# EAGLE design supply_board (EAGLE 7.7.0)
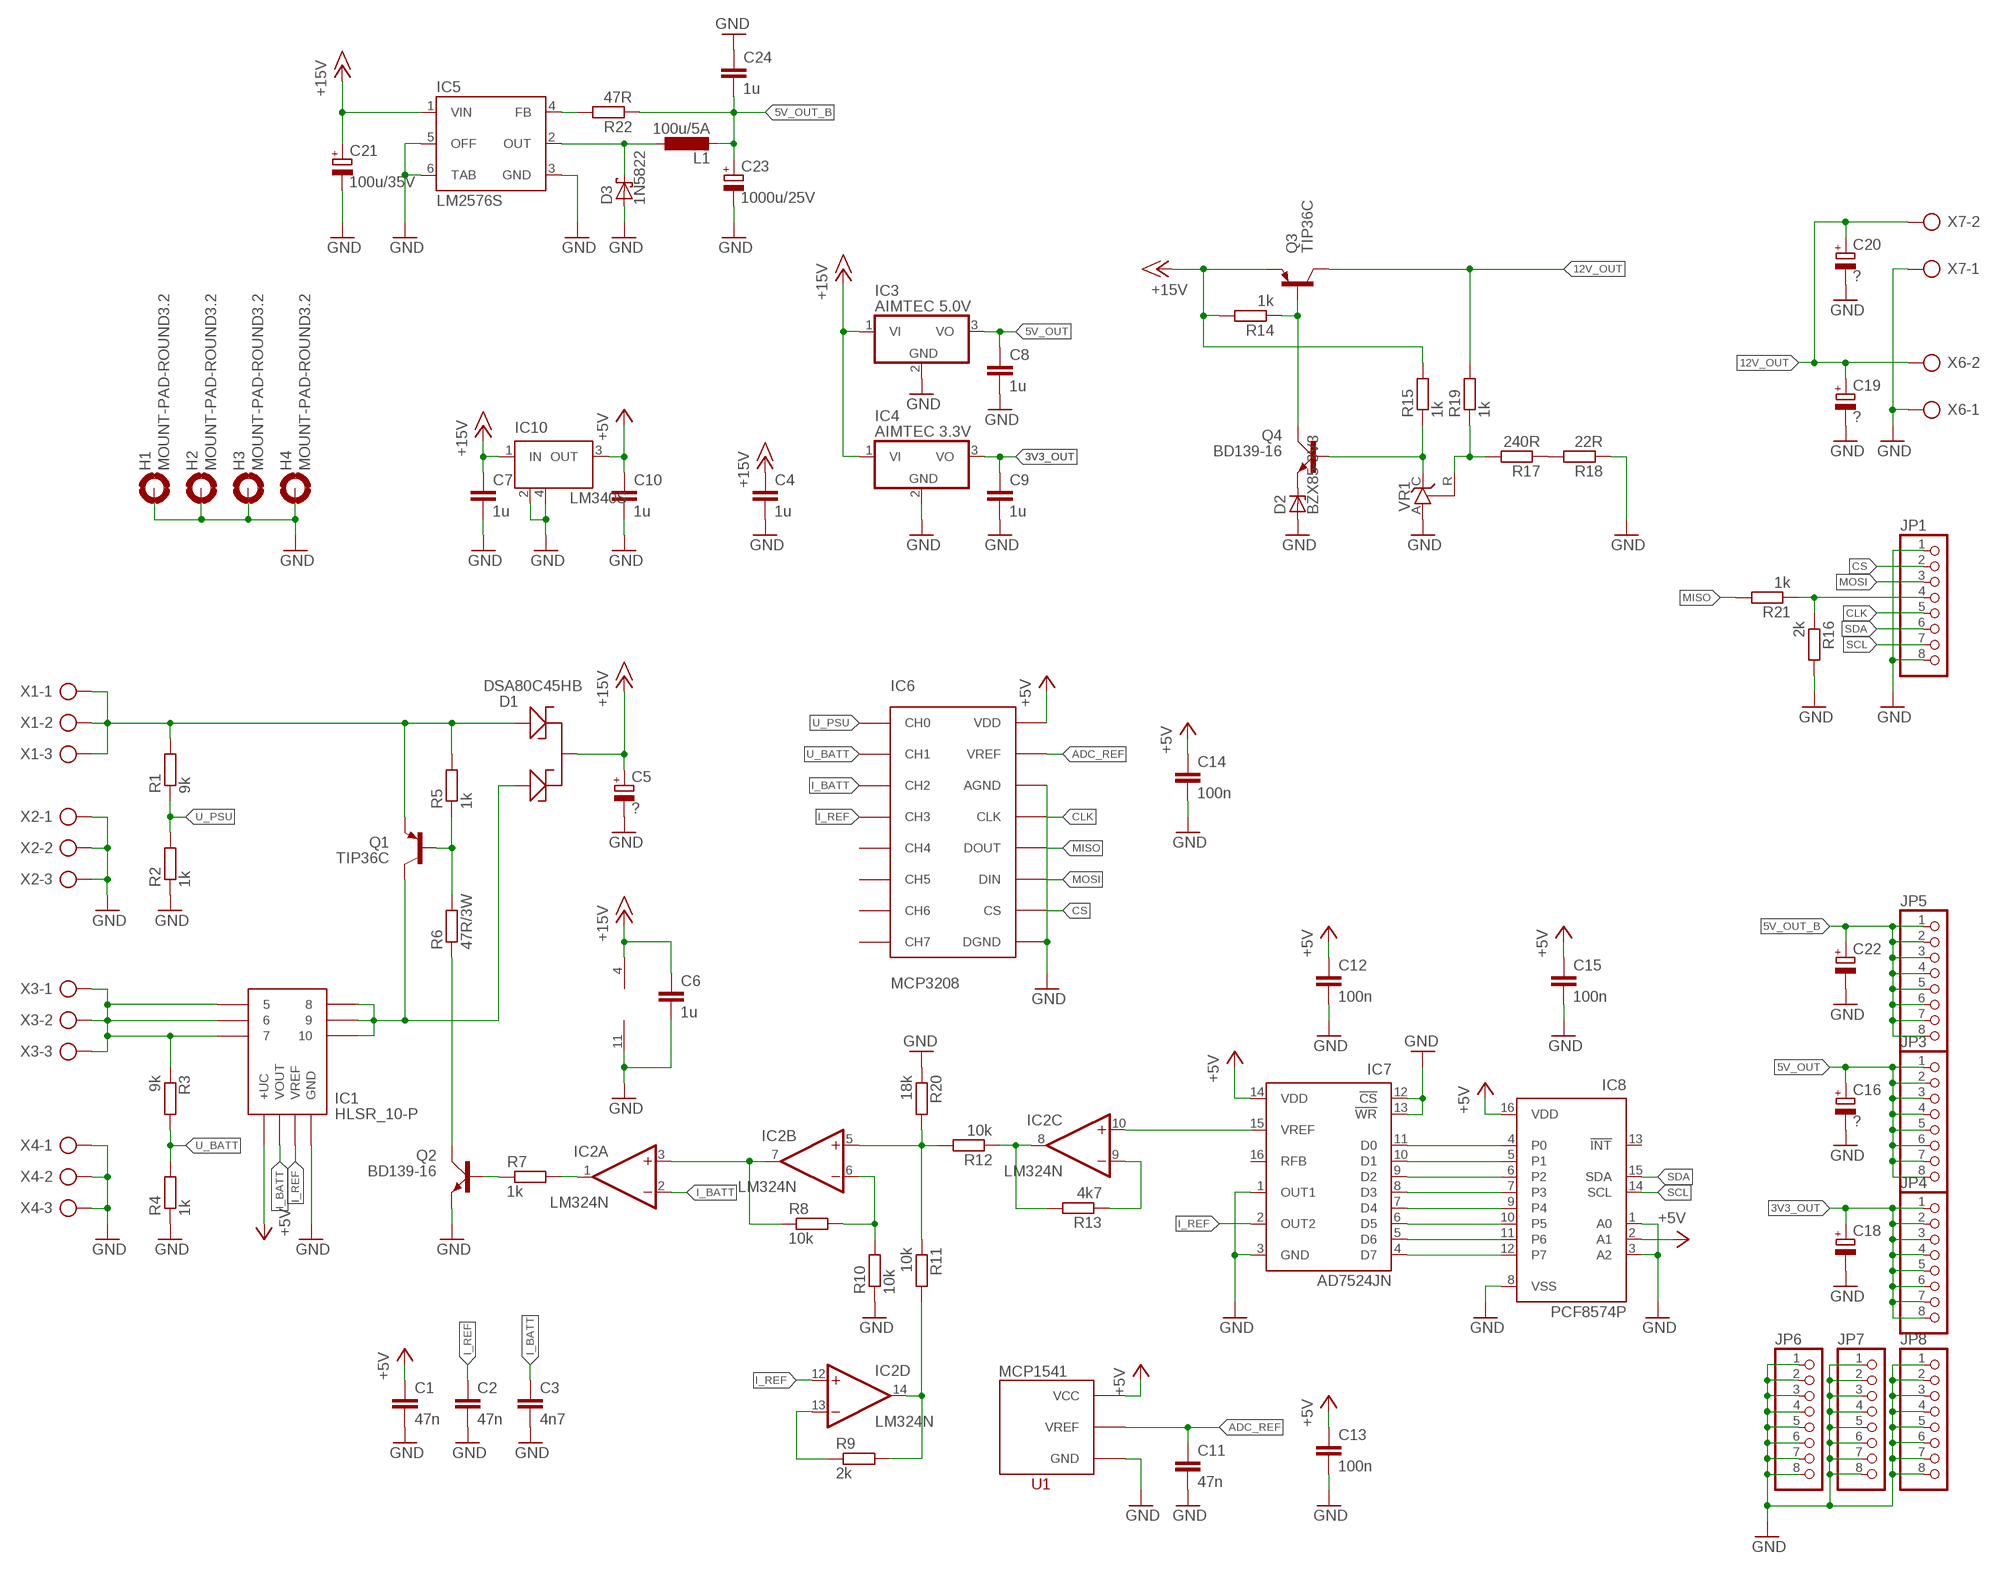
[diagram p0: schematic, sheet 1]

## Parts
C1  47n  C-EUC0805  [C0805]
C2  47n  C-EUC0805  [C0805]
C3  4n7  C-EUC0805  [C0805]
C4  1u  C-EUC0805  [C0805]
C5  ?  CPOL-EUE5-13  [E5-13]
C6  1u  C-EUC0805  [C0805]
C7  1u  C-EUC0805  [C0805]
C8  1u  C-EUC0805  [C0805]
C9  1u  C-EUC0805  [C0805]
C10  1u  C-EUC0805  [C0805]
C11  47n  C-EUC0805  [C0805]
C12  100n  C-EUC0805  [C0805]
C13  100n  C-EUC0805  [C0805]
C14  100n  C-EUC0805  [C0805]
C15  100n  C-EUC0805  [C0805]
C16  ?  CPOL-EUE2.5-6  [E2,5-6]
C18  CPOL-EUE2.5-6  [E2,5-6]
C19  ?  CPOL-EUE5-13  [E5-13]
C20  ?  CPOL-EUE5-13  [E5-13]
C21  100u/35V  CPOL-EUE5-10.5  [E5-10,5]
C22  CPOL-EUE2.5-6  [E2,5-6]
C23  1000u/25V  CPOL-EUE5-10.5  [E5-10,5]
C24  1u  C-EUC0805  [C0805]
D1  DSA80C45HB  [TO247BV]
D2  BZX85-3V3  BZX85  [DO41Z10]
D3  1N5822  1N5908  [C4111-15]
H1  MOUNT-PAD-ROUND3.2  [3,2-PAD]
H2  MOUNT-PAD-ROUND3.2  [3,2-PAD]
H3  MOUNT-PAD-ROUND3.2  [3,2-PAD]
H4  MOUNT-PAD-ROUND3.2  [3,2-PAD]
IC1  HLSR_10-P  [HLSR16-P]
IC2  LM324N  [DIL14]
IC3  AIMTEC 5.0V  7805TV  [TO220V]
IC4  AIMTEC 3.3V  7805TV  [TO220V]
IC5  LM2576S  [TO263-5]
IC6  MCP3208  [DIL16]
IC7  AD7524JN  [DIL16]
IC8  PCF8574P  [DIL16]
IC10  LM340S  [SOT223]
JP1  PINHD-1X8  [1X08]
JP3  PINHD-1X8  [1X08]
JP4  PINHD-1X8  [1X08]
JP5  PINHD-1X8  [1X08]
JP6  PINHD-1X8  [1X08]
JP7  PINHD-1X8  [1X08]
JP8  PINHD-1X8  [1X08]
L1  100u/5A  L-EUTJ5-U2  [TJ5-U2]
Q1  TIP36C  TIP36-V  [TO247-V]
Q2  BD139-16  BD139  [TO126AV]
Q3  TIP36C  TIP36-V  [TO247-V]
Q4  BD139-16  BD139  [TO126AV]
R1  9k  R-EU_R0805  [R0805]
R2  1k  R-EU_R0805  [R0805]
R3  9k  R-EU_R0805  [R0805]
R4  1k  R-EU_R0805  [R0805]
R5  1k  R-EU_R0805  [R0805]
R6  47R/3W  R-EU_0617/22  [0617/22]
R7  1k  R-EU_R0805  [R0805]
R8  10k  R-EU_R0805  [R0805]
R9  2k  R-EU_R0805  [R0805]
R10  10k  R-EU_R0805  [R0805]
R11  10k  R-EU_R0805  [R0805]
R12  10k  R-EU_R0805  [R0805]
R13  4k7  R-EU_R0805  [R0805]
R14  1k  R-EU_R0805  [R0805]
R15  1k  R-EU_R0805  [R0805]
R16  2k  R-EU_R0805  [R0805]
R17  240R  R-EU_R0805  [R0805]
R18  22R  R-EU_R0805  [R0805]
R19  1k  R-EU_R0805  [R0805]
R20  18k  R-EU_R0805  [R0805]
R21  1k  R-EU_R0805  [R0805]
R22  47R  R-EU_R0805  [R0805]
U1  VOLT_REFERENCE  [SOT23]
VR1  TL431CLP  [TO92-CLP]
X1  AK500/3  [AK500/3]
X2  AK500/3  [AK500/3]
X3  AK500/3  [AK500/3]
X4  AK500/3  [AK500/3]
X6  AK500/2  [AK500/2]
X7  AK500/2  [AK500/2]

## Nets
3V3_OUT: C9.1 C18.+ IC4.3(VO) JP4.1 JP4.2 JP4.3 JP4.4 JP4.5 JP4.6 JP4.7 JP4.8
5V_OUT: C8.1 C16.+ IC3.3(VO) JP3.1 JP3.2 JP3.3 JP3.4 JP3.5 JP3.6 JP3.7 JP3.8
5V_OUT_B: C22.+ C23.+ C24.2 JP5.1 JP5.2 JP5.3 JP5.4 JP5.5 JP5.6 JP5.7 JP5.8 L1.2 R22.1
12V_OUT: C19.+ C20.+ Q3.2(C) R19.2 X6.2 X7.2
+5V: C1.1 C10.1 C12.1 C13.1 C14.1 C15.1 IC1.4(+UC) IC6.VDD IC7.14(VDD) IC8.2(A1) IC8.16(VDD) IC10.3(OUT) U1.1(VCC)
+15V: C4.1 C5.+ C6.1 C7.1 C21.+ D1.2 IC2.4(P:V+) IC3.1(VI) IC4.1(VI) IC5.1(VIN) IC10.1(IN) Q3.3(E) R14.2 R15.2
ADC_REF: C11.1 IC6.VREF U1.2(VREF)
CLK: IC6.CLK JP1.5
CS: IC6.CS JP1.2
GND: C1.2 C2.2 C3.2 C4.2 C5.- C6.2 C7.2 C8.2 C9.2 C10.2 C11.2 C12.2 C13.2 C14.2 C15.2 C16.- C18.- C19.- C20.- C21.- C22.- C23.- C24.1 D2.A D3.A H1.B3,2(MOUNT) H2.B3,2(MOUNT) H3.B3,2(MOUNT) H4.B3,2(MOUNT) IC1.3(GND) IC2.11(P:V-) IC3.2(GND) IC4.2(GND) IC5.3(GND) IC5.5(OFF) IC5.6(TAB) IC6.AGND IC6.DGND IC7.1(OUT1) IC7.3(GND) IC7.12(!CS) IC7.13(!WR) IC8.1(A0) IC8.3(A2) IC8.8(VSS) IC10.2(GND) JP1.1 JP1.8 JP6.1 JP6.2 JP6.3 JP6.4 JP6.5 JP6.6 JP6.7 JP6.8 JP7.1 JP7.2 JP7.3 JP7.4 JP7.5 JP7.6 JP7.7 JP7.8 JP8.1 JP8.2 JP8.3 JP8.4 JP8.5 JP8.6 JP8.7 JP8.8 Q2.E R2.1 R4.1 R10.1 R16.2 R18.1 R20.1 U1.3(GND) VR1.A X2.1 X2.2 X2.3 X4.1 X4.2 X4.3 X6.1 X7.1
I_BATT: C3.1 IC1.2(VOUT) IC2.2(A:-IN) IC6.CH2
I_REF: C2.1 IC1.1(VREF) IC2.12(D:+IN) IC6.CH3 IC7.2(OUT2)
MISO: IC6.DOUT R21.2
MOSI: IC6.DIN JP1.3
N$1: IC1.5 IC1.6 IC1.7 R3.1 X3.1 X3.2 X3.3
N$2: D1.3 IC1.8 IC1.9 IC1.10 Q1.2(C)
N$3: Q1.1(B) R5.1 R6.2
N$4: Q2.C R6.1
N$5: IC2.6(B:-IN) R8.2 R10.2
N$6: D1.1 Q1.3(E) R1.2 R5.2 X1.1 X1.2 X1.3
N$7: Q2.B R7.1
N$8: IC2.1(A:OUT) R7.2
N$9: IC2.13(D:-IN) R9.1
N$10: IC2.3(A:+IN) IC2.7(B:OUT) R8.1
N$11: IC2.14(D:OUT) R9.2 R11.2
N$12: IC2.5(B:+IN) R11.1 R12.2 R20.2
N$13: IC2.8(C:OUT) R12.1 R13.2
N$14: IC7.11(D0) IC8.4(P0)
N$15: IC7.10(D1) IC8.5(P1)
N$16: IC7.9(D2) IC8.6(P2)
N$17: IC7.8(D3) IC8.7(P3)
N$18: Q3.1(B) Q4.C R14.1
N$19: IC7.7(D4) IC8.9(P4)
N$20: IC7.6(D5) IC8.10(P5)
N$21: IC7.5(D6) IC8.11(P6)
N$22: IC7.4(D7) IC8.12(P7)
N$23: Q4.B R15.1 VR1.C
N$24: D2.C Q4.E
N$25: IC2.9(C:-IN) R13.1
N$26: IC2.10(C:+IN) IC7.15(VREF)
N$27: JP1.4 R16.1 R21.1
N$30: R17.1 R18.2
N$31: IC5.4(FB) R22.2
N$32: R17.2 R19.1 VR1.R
N$33: D3.C IC5.2(OUT) L1.1
SCL: IC8.14(SCL) JP1.7
SDA: IC8.15(SDA) JP1.6
U_BATT: IC6.CH1 R3.2 R4.2
U_PSU: IC6.CH0 R1.1 R2.2
Unconnected: IC6.CH4 IC6.CH5 IC6.CH6 IC6.CH7 IC7.16(RFB) IC8.13(!INT)

## Power pins joined to a net without a drawn wire
GND: IC10.4(GND)

## Library data of the parts
C1-C4 C6-C15 C24 = rcl:C-EU: CAPACITOR, European symbol
C5 C16 C18-C23 = rcl:CPOL-EU: POLARIZED CAPACITOR, European symbol
D1 = DSA80C45HB:DSA80C45HB: DSA80C45HB
D2 = diode:BZX85: Z DIODE
D3 = diode:1N5908: DIODE schottky
H1-H4 = holes:MOUNT-PAD-ROUND: MOUNTING PAD, round
IC1 = HLSR_10-P:HLSR_10-P: LEM ASIC Open Loop Hall Effect Current Sensor, Maximum of 25 A, 10A output current Source: Datasheet <http://www.lem.com/docs/products/hlsr-p_series.pdf>; DESCRIPTION: LEM ASIC Open Loop Hall Effect Current Sensor, Maximum of 25 A, 10A output current; HEIGHT: mm; MANUFACTURER_NAME: LEM; MANUFACTURER_PART_NUMBER: HLSR 10-P; RS_PART_NUMBER: 7934584; RS_PRICE-STOCK: http://uk.rs-online.com/web/p/products/7934584
IC2 = linear:LM324: OP AMP
IC3 IC4 = linear:78*: Positive VOLTAGE REGULATOR Source: http://cache.national.com/ds/LM/LM78L05.pdf http://www.fairchildsemi.com/ds/LM/LM7805.pdf
IC5 = v-reg-3:LM2576: National Semiconductor <http://www.national.com> 3.0A "Simple Switcher"(c) 52kHz, Vout 1.23-37V (HV: 57V), Vin 40V (HV: 60V), 50µA standby current
IC6 = mcp3208:MCP3208
IC7 = analog-devices:AD7524*: 8-Bit Buffered Multiplying DAC Source: http://www.analog.com/UploadedFiles/Data_Sheets/888358036ad7524.pdf; MF: ALTERA CORPORATION; MPN: AD7524JNZ; OC_FARNELL: 9605401; OC_NEWARK: 59K4969
IC8 = micro-philips:PCF8574: I2C-Bus Remote 8-bit I/O expander http://www.semiconductors.philips.com/acrobat_download/datasheets/PCF8574_4.pdf; MPN: PCF8574PN; OC_FARNELL: 204020; OC_NEWARK: 11N8515
IC10 = linear:LM340S: 3-Terminal Positive Regulators Source: http://cache.national.com/ds/LM/LM340.pdf
JP1 JP3-JP8 = pinhead:PINHD-1X8: PIN HEADER
L1 = rcl:L-EU: INDUCTOR, European symbol
Q1 Q3 = transistor-pnp2:TIP36: PNP Power Transistor
Q2 Q4 = transistor-power:BD139: NPN TRANSISTOR
R1-R5 R7-R22 = resistor:R-EU_: RESISTOR, European symbol
R6 = rcl:R-EU_: RESISTOR, European symbol
U1 = icnh3:VOLT_REFERENCE
VR1 = v-reg:TL431CLP: VOLTAGE REGULATOR
X1-X4 = con-ptr500:AK500/3: CONNECTOR; OC_FARNELL: unknown; OC_NEWARK: unknown
X6 X7 = con-ptr500:AK500/2: CONNECTOR; OC_FARNELL: unknown; OC_NEWARK: unknown

## Board
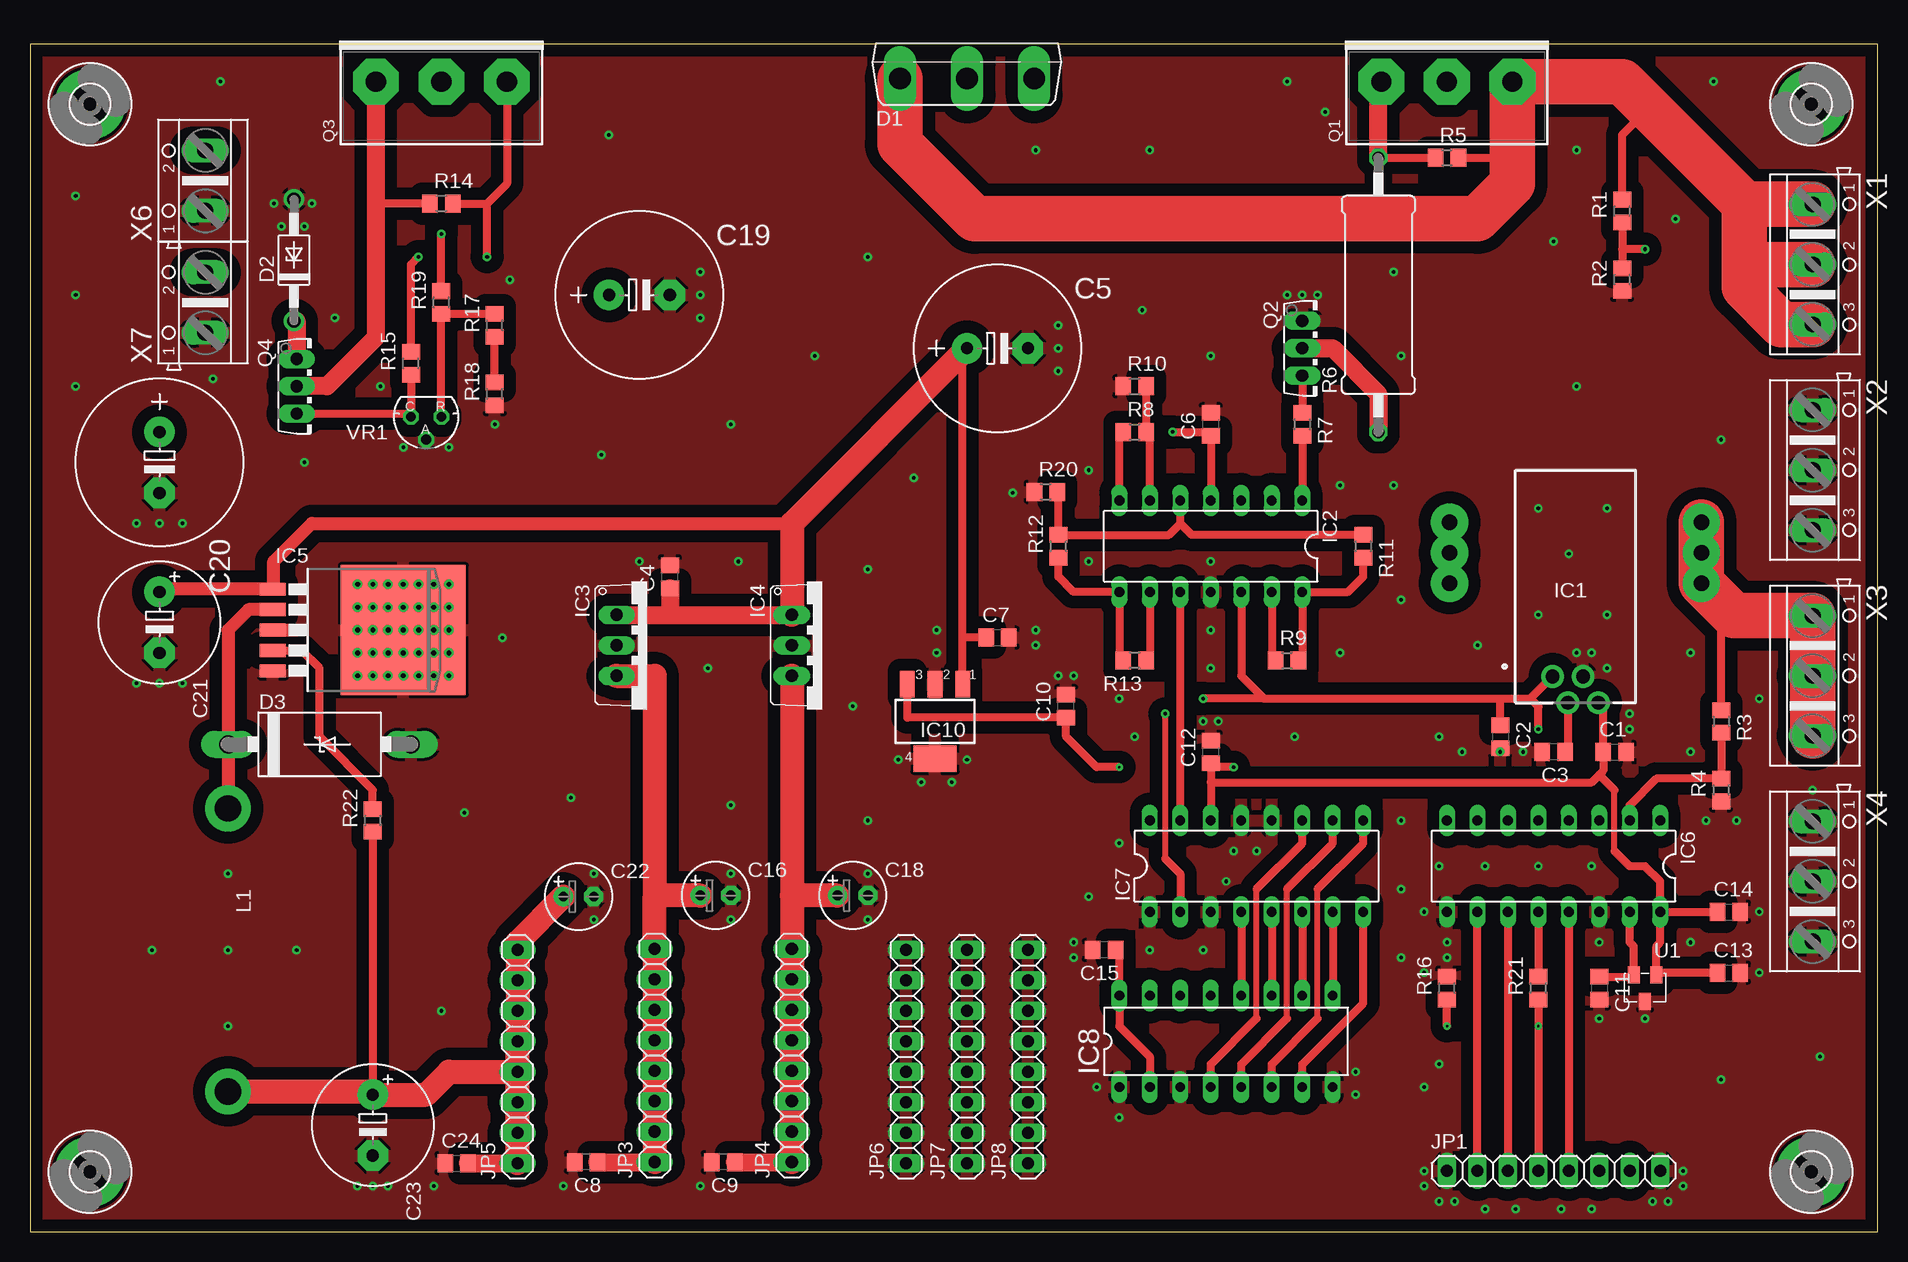
[diagram p1: board, top side]
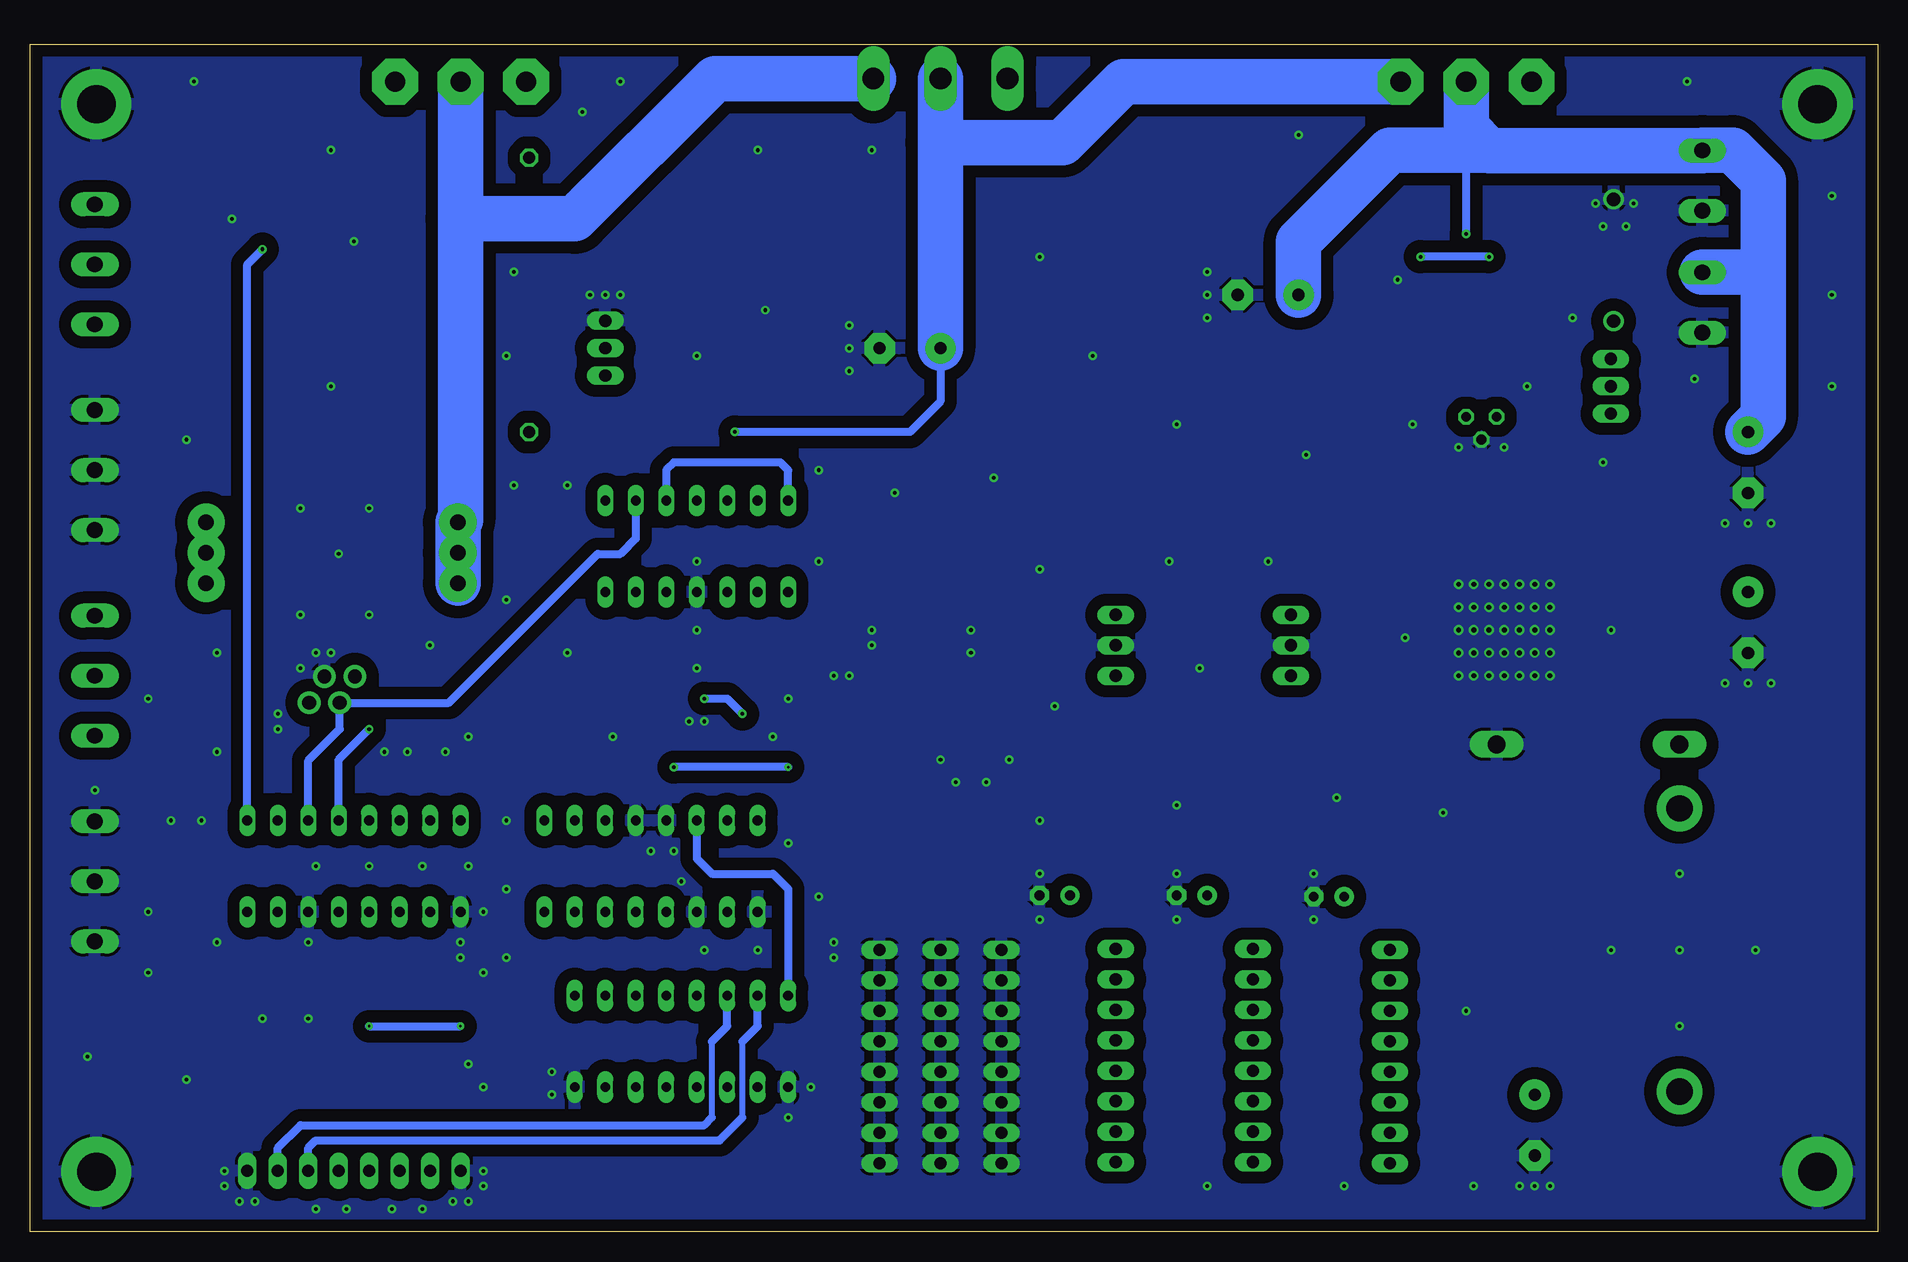
[diagram p2: board, bottom side, seen from below]

Size 154 x 99 mm. Coordinates in mm from the lower left corner, seen from the top.
Outline: 0,0 154,0 154,99 0,99 0,0
Copper layers (1*16): Top 0.035mm / dielectric 1.5mm / Bottom 0.035mm
Design rules "default *": minimum track width 10mil, minimum drill 24mil, track to track 8mil, track to pad 8mil, pad to pad 8mil, via to via 8mil, smd to smd 8mil, copper to edge 40mil, drill to drill 8mil, minimum pad ring 10mil, minimum via ring 8mil, stop-mask expansion 4mil, vias tented up to drill 0.3mm, thermal gap 10mil

### Footprints (pad centres in the part's own frame; a part is rotated, then mirrored left to right if it is on the bottom)
C0805 = smd 1.3 x 1.5: 1 -0.95,0; 2 0.95,0
E5-13 = drill 1.016 pad 2.54: + -2.54,0 | drill 1.016 pad 2.54 octagon: - 2.54,0
E2,5-6 = drill 0.813 pad 1.6: + -1.27,0 | drill 0.813 pad 1.6 octagon: - 1.27,0
E5-10,5 = drill 1.016 pad 2.54: + -2.54,0 | drill 1.016 pad 2.54 octagon: - 2.54,0
TO247BV = drill 1.8 long: 1 -5.588,-2.921; 2 0,-2.921; 3 5.588,-2.921
DO41Z10 = drill 1.118: A 5.08,0; C -5.08,0
C4111-15 = drill 1.499 long: A 7.62,0; C -7.62,0
3,2-PAD = drill 3.2 pad 5.842: B3,2 0,0
HLSR16-P = drill 1.15 pad 1.9: 1 3.09,-17.2; 2 4.36,-19.4; 3 5.63,-17.2; 4 6.9,-19.4 | drill 1.3 pad 3.1: 5 15.5,-9.43; 6 15.5,-6.89; 7 15.5,-4.35; 8 -5.5,-4.35; 9 -5.5,-6.89; 10 -5.5,-9.43
DIL14 = drill 0.813 long: 1 -7.62,-3.81; 2 -5.08,-3.81; 3 -2.54,-3.81; 4 0,-3.81; 5 2.54,-3.81; 6 5.08,-3.81; 7 7.62,-3.81; 8 7.62,3.81; 9 5.08,3.81; 10 2.54,3.81; 11 0,3.81; 12 -2.54,3.81; 13 -5.08,3.81; 14 -7.62,3.81
TO220V = drill 1.016 long: 1 -2.54,-2.54; 2 0,-2.54; 3 2.54,-2.54
TO263-5 = smd 1.067 x 2.159: 1 -3.404,-5.791; 2 -1.702,-5.791; 3 0,-5.791; 4 1.702,-5.791; 5 3.404,-5.791 | smd 10.8 x 10.41: 6 0,5.08
DIL16 = drill 0.813 long: AGND -3.81,3.81; CH0 -8.89,-3.81; CH1 -6.35,-3.81; CH2 -3.81,-3.81; CH3 -1.27,-3.81; CH4 1.27,-3.81; CH5 3.81,-3.81; CH6 6.35,-3.81; CH7 8.89,-3.81; CLK -1.27,3.81; CS 6.35,3.81; DGND 8.89,3.81; DIN 3.81,3.81; DOUT 1.27,3.81; VDD -8.89,3.81; VREF -6.35,3.81
DIL16' = drill 0.813 long: 1 -8.89,-3.81; 2 -6.35,-3.81; 3 -3.81,-3.81; 4 -1.27,-3.81; 5 1.27,-3.81; 6 3.81,-3.81; 7 6.35,-3.81; 8 8.89,-3.81; 9 8.89,3.81; 10 6.35,3.81; 11 3.81,3.81; 12 1.27,3.81; 13 -1.27,3.81; 14 -3.81,3.81; 15 -6.35,3.81; 16 -8.89,3.81
SOT223 = smd 1.219 x 2.235: 1 -2.311,-3.099; 2 0,-3.099; 3 2.311,-3.099 | smd 3.6 x 2.2: 4 0,3.099
1X08 = drill 1.016 long: 1 -8.89,0; 2 -6.35,0; 3 -3.81,0; 4 -1.27,0; 5 1.27,0; 6 3.81,0; 7 6.35,0; 8 8.89,0
TJ5-U2 = drill 2.2 pad 3.81: 1 -11.8,0; 2 11.8,0
TO247-V = drill 1.676 pad 3.81 octagon: 1 -5.461,0; 2 0,0; 3 5.461,0
TO126AV = drill 1.016 long: B 2.286,-1.27; C 0,-1.27; E -2.286,-1.27
R0805 = smd 1.3 x 1.5: 1 -0.95,0; 2 0.95,0
0617/22 = drill 1.016 octagon: 1 -11.43,0; 2 11.43,0
SOT23 = smd 1 x 1.4: 1 -0.95,-1.1; 2 0.95,-1.1; 3 0,1.1
TO92-CLP = drill 0.813 octagon: A 0,1.905; C 1.27,0; R -1.27,0
AK500/3 = drill 1.321 long: 1 -5.004,0; 2 0,0; 3 5.004,0
AK500/2 = drill 1.321 long: 1 -2.515,0; 2 2.515,0

### Placement (x,y rotation side)
C1  132.08,40.01 0 top
C2  122.56,41.27 270 top
C3  127,40.01 180 top
C4  53.34,54.61 90 top
C5  80.64,73.66 0 top
C6  98.42,67.31 90 top
C7  80.64,49.53 0 top
C8  46.35,5.81 180 top
C9  57.78,5.81 180 top
C10  86.36,43.81 90 top
C11  130.81,20.32 270 top
C12  98.42,40.01 90 top
C13  141.6,21.59 0 top
C14  141.6,26.67 0 top
C15  89.53,23.5 180 top
C16  57.15,28.04 0 top
C18  68.58,28.04 0 top
C19  50.8,78.11 0 top
C20  10.79,64.14 270 top
C21  10.79,50.8 270 top
C22  45.72,27.94 0 top
C23  28.57,8.89 270 top
C24  35.56,5.71 0 top
D1  78.11,99.06 0 top
D2  22,81 90 top
D3  24.13,40.64 0 top
H1  5,5 0 top
H2  148.47,5 0 top
H3  148.47,94 0 top
H4  5,94 0 top
IC1  123.83,63.5 0 top
IC2  98.42,57.15 180 top
IC3  51.44,48.9 270 top
IC4  66.04,48.9 270 top
IC5  26.04,50.16 270 top
IC6  127,30.48 180 top
IC7  AD7524JN  [DIL16']  102.23,30.48 0 top
IC8  PCF8574P  [DIL16']  99.69,15.88 0 top
IC10  75.44,42.55 180 top
JP1  127,5.08 0 top
JP3  52.07,14.7 90 top
JP4  63.5,14.7 90 top
JP5  40.64,14.61 90 top
JP6  73.03,14.61 90 top
JP7  78.11,14.61 90 top
JP8  83.19,14.61 90 top
L1  16.51,23.5 270 top
Q1  118.11,95.89 0 top
Q2  107.31,73.66 270 top
Q3  34.29,95.89 0 top
Q4  23.5,70.48 270 top
R1  132.72,85.09 90 top
R2  132.72,79.38 90 top
R3  140.97,42.55 270 top
R4  140.97,36.83 90 top
R5  118.11,89.53 0 top
R6  112.39,78.11 90 top
R7  106.05,67.31 270 top
R8  92.08,66.67 0 top
R9  104.78,47.62 0 top
R10  92.08,70.48 0 top
R11  111.12,57.15 270 top
R12  85.72,57.15 90 top
R13  92.08,47.62 180 top
R14  34.29,85.72 0 top
R15  31.75,72.39 90 top
R16  118.11,20.32 90 top
R17  38.73,75.56 90 top
R18  38.73,69.85 90 top
R19  34.29,77.47 90 top
R20  84.68,61.68 0 top
R21  125.73,20.32 90 top
R22  28.57,34.29 90 top
U1  134.62,20.32 180 top
VR1  33.02,67.94 180 top
X1  148.59,80.64 270 top
X2  148.59,63.5 270 top
X3  148.59,46.35 270 top
X4  148.59,29.21 270 top
X6  14.61,87.63 90 top
X7  14.61,77.47 90 top

### Tracks (layer width: path | path; a pad name or v marks a point on that pad's centre or on a via)
3V3_OUT
  Top 1.5: C9.1 JP4.1
  Top 2: JP4.1 JP4.2 JP4.3 JP4.4 JP4.5 JP4.6 JP4.7 JP4.8 63.5,28.04 | IC4.3 63.5,28.04 | C18.+ 63.5,28.04
5V_OUT
  Top 1.5: C8.1 JP3.1
  Top 2: JP3.1 JP3.2 JP3.3 JP3.4 JP3.5 JP3.6 JP3.7 JP3.8 52.07,27.94 | C16.+ 52.16,28.04 arc90 52.07,27.94 | IC3.3 52.07,46.35 52.07,27.94
5V_OUT_B
  Top 0.66: R22.1 C23.+
  Top 1.1: 16.77,11.43 L1.2
  Top 1.5: C24.2 JP5.1
  Top 2: L1.2 28.31,11.7 C23.+ 33.02,11.43 34.92,13.34 JP5.4 | JP5.4 JP5.5 JP5.6 JP5.7 JP5.8 40.64,24.13 C22.+ | JP5.1 JP5.2 JP5.3 JP5.4
12V_OUT  (via drill 0.3)
  Top 0.66: R19.2 v34.29,83.19
  Bottom 0.66: v34.29,83.19 34.29,90.17
  Bottom 3.81: 32.38,90.17 32.36,90.14 X6.2 14.58,90.17 12.06,90.17 9.53,87.63 9.53,80.01 | 32.38,90.17 34.29,92.08 Q3.2 | C19.+ 48.26,82.55 40.64,90.17 34.29,90.17 32.38,90.17 | X7.2 14.58,80.01 9.53,80.01 | C20.+ 9.53,67.94 9.53,80.01
+5V  (via drill 0.2, 0.3)
  Top 0.508: 132.08,31.75 132.08,36.83
  Top 0.66: IC1.4 131.13,43.7 C1.1 131.13,38.42 130.81,38.1 | 98.42,37.47 130.18,37.47 130.81,38.1 | 98.42,37.47 C12.1 98.75,38.73 v100.33,38.73 | 98.42,37.47 IC7.14 | IC8.2 93.34,14.61 90.81,17.14 IC8.16 90.81,23.18 C15.1 | IC6.VDD C14.1 | IC6.VDD 135.89,24.13 135.57,23.81 U1.1 135.74,21.59 C13.1 | IC6.VDD 135.89,29.21 134.62,30.48 133.35,30.48 132.08,31.75 | 132.08,36.83 130.81,38.1 | IC10.3 73.13,42.87 C10.1 86.36,41.27 88.9,38.73 v90.81,38.73
  Bottom 0.66: IC7.14 98.42,31.11 97.16,29.84 92.08,29.84 90.81,28.57 IC8.16 | v90.81,38.73 v100.33,38.73
+15V  (via drill 0.3)
  Top 0.66: IC2.4 C6.1 98.11,66.67 v95.25,66.67 | R14.2 38.1,85.72 | 38.1,85.72 39.75,87.38 Q3.3 | 77.71,49.53 77.71,73.27 C5.+ | C7.1 77.71,49.53 | R15.2 31.75,80.64 v32.38,81.28 | v38.1,81.28 38.1,85.72 | IC10.1 77.71,45.64 77.71,49.53
  Top 1.1: C21.+ 11.02,53.57 IC5.1 20.32,53.65 20.32,55.88 23.5,59.05 63.5,59.05
  Top 1.5: IC3.1 53.34,51.44 | 53.34,51.44 IC4.1 | C4.1 53.34,51.44
  Top 2: C5.+ 63.5,59.05 IC4.1
  Bottom 0.66: C5.+ 78.11,69.22 80.64,66.67 v95.25,66.67 | v32.38,81.28 v38.1,81.28
  Bottom 3.81: D1.2 78.11,90.81 | 78.11,90.81 C5.+ | Q3.3 62.87,95.89 67.94,90.81 78.11,90.81
ADC_REF
  Top 0.66: C11.1 133.52,21.27 U1.2 133.67,23.81 133.35,24.13 IC6.VREF
CLK
  Top 0.66: IC6.CLK JP1.5
CS
  Top 0.66: JP1.2 IC6.CS
GND  (via drill 0.3, 0.4)
  Top 1.1: IC5.3 v22.23,50.16
  other vias: 27.3,53.98 28.57,53.98 31.11,53.98 34.92,53.98 33.66,53.98 29.84,53.98 32.38,53.98 75.56,50.16 75.56,48.26 72.39,39.37 74.3,37.47 76.83,37.47 78.11,39.37 85.72,46.35 87,46.35 83.82,48.9 83.82,50.16 99.06,42.55 97.79,42.55 102.23,31.75 100.33,31.75 99.69,29.21 105.41,41.27 117.47,41.27 109.22,48.26 98.42,46.99 98.42,50.16 98.42,55.88 88.27,55.88 81.92,61.59 114.3,52.7 120.65,48.9 128.91,48.26 130.18,48.26 131.44,46.99 124.46,40.01 119.38,40.01 122.56,40.01 133.35,41.91 133.35,43.18 139.7,34.29 142.24,34.29 138.43,48.26 138.43,40.01 90.81,32.38 88.27,27.94 93.34,23.5 97.79,23.5 87,24.13 87,22.86 130.18,30.48 125.73,30.48 121.28,30.48 117.47,30.48 118.11,24.13 116.2,26.67 118.11,22.86 116.2,21.59 114.3,34.29 114.3,28.57 114.3,22.86 110.49,11.43 110.49,13.34 117.47,13.97 116.2,12.06 116.2,5.08 116.2,3.81 117.47,2.54 118.75,2.54 123.83,1.91 127.64,1.91 121.28,1.91 130.18,1.91 135.25,2.54 136.53,2.54 137.79,3.81 137.79,5.08 20.32,85.72 23.5,85.72 20.95,83.82 22.86,83.82 29.21,70.48 31.11,65.41 34.92,65.41 38.73,67.31 83.82,90.17 93.34,90.17 104.78,95.89 107.95,93.34 140.34,95.89 128.91,90.17 127,82.55 113.67,80.01 106.05,78.11 104.78,78.11 107.31,78.11 85.72,75.56 85.72,73.66 85.72,71.75 55.88,78.11 55.88,80.01 55.88,76.2 10.79,59.05 12.7,59.05 8.89,59.05 10.79,45.72 8.89,45.72 12.7,45.72 27.3,52.07 28.57,52.07 31.11,52.07 34.92,52.07 33.66,52.07 29.84,52.07 32.38,52.07 27.3,50.16 28.57,50.16 31.11,50.16 34.92,50.16 33.66,50.16 29.84,50.16 32.38,50.16 27.3,48.26 28.57,48.26 31.11,48.26 34.92,48.26 33.66,48.26 29.84,48.26 32.38,48.26 27.3,46.35 28.57,46.35 31.11,46.35 34.92,46.35 33.66,46.35 29.84,46.35 32.38,46.35 10.16,23.5 16.51,23.5 22.23,23.5 16.51,17.14 16.51,29.84 46.99,26.04 46.99,29.84 58.42,26.04 58.42,29.84 69.85,26.04 69.85,29.84 28.57,3.81 27.3,3.81 29.84,3.81 33.66,3.81 44.45,3.81 55.88,3.81 34.29,18.41 36.2,34.92 45.09,36.2 56.52,46.99 58.42,35.56 69.85,34.29 90.81,9.53 88.9,12.06 130.81,17.78 134.62,17.78 144.15,21.59 144.15,26.67 130.81,24.13 138.43,24.13 92.08,41.27 90.81,44.45 144.15,44.45 148.59,36.83 125.73,60.33 131.44,60.33 128.27,56.52 125.73,51.44 131.44,51.44 109.22,62.23 113.67,62.23 128.91,70.48 114.3,73.03 140.97,66.04 137.16,84.45 92.71,76.83 98.42,73.03 88.27,63.5 73.66,62.87 69.85,55.24 68.58,43.81 59.05,55.88 50.8,55.88 40.01,79.38 25.4,76.2 15.24,71.12 3.81,70.48 3.81,86.36 3.81,78.11 15.88,95.89 48.26,91.44 69.85,81.28 65.41,73.03 58.42,67.31 47.62,64.77 22.86,64.14 39.37,49.53 140.97,12.7 149.22,14.61
  pour Top (isolate 1.016): 0,0 154,0 154,99 0,99
  pour Bottom (isolate 1.016): 0,0 154,0 154,99 0,99
I_BATT
  Top 0.66: IC1.2 128.19,40.24 C3.1
  Bottom 0.66: IC2.2 103.5,57.78 104.78,56.52 106.68,56.52 119.09,44.1 IC1.2 128.19,41.91 130.81,39.28 IC6.CH2
I_REF  (via drill 0.3)
  Top 0.508: v94.61,43.18 94.61,31.11
  Top 0.66: IC2.12 100.97,46.35 102.87,44.45 | 102.87,44.45 122.56,44.45 | 122.56,44.45 125.06,44.45 | 125.06,44.45 IC1.1 | C2.1 122.56,44.45 | 102.87,44.45 v97.79,44.45 | 94.61,31.11 95.89,29.84 IC7.2 | v125.73,41.91 125.73,43.78 125.06,44.45
  Bottom 0.66: v97.79,44.45 95.89,44.45 v94.61,43.18 | IC6.CH3 128.27,39.37 v125.73,41.91
MISO
  Top 0.66: IC6.DOUT R21.2
MOSI
  Top 0.66: IC6.DIN JP1.3
N$1
  Top 0.66: R3.1 140.97,50.8 141.53,51.36 142.04,51.36
  Top 3.81: IC1.7 IC1.6 IC1.5 142.04,51.36 X3.1 X3.2 X3.3
N$2
  Bottom 3.81: Q1.2 118.11,84.45 | 118.11,84.45 118.11,59.37 IC1.8 IC1.9 IC1.10 | D1.3 96.9,96.14 108.58,84.45 118.11,84.45
N$3
  Top 0.66: R6.2 R5.1
  Top 1.5: R6.2 112.39,95.63 Q1.1
N$4
  Top 1.5: Q2.C 108.58,73.66 112.39,69.85 R6.1
N$5
  Top 0.66: IC2.6 93.34,66.36 R8.2 R10.2
N$6
  Top 0.66: R1.2 132.72,91.44 134.94,93.66 | R5.2 123.57,89.53
  Top 3.81: 142.88,85.72 134.94,93.66 132.72,95.89 Q1.3 123.57,89.53 123.57,87.38 120.65,84.45 78.74,84.45 72.52,90.68 D1.1 | X1.3 145.97,75.64 142.88,78.74 142.88,80.64 | 142.88,80.64 142.88,85.72 | X1.2 142.88,80.64 | X1.1 142.95,85.65 142.88,85.72
N$7
  Top 0.66: Q2.B R7.1
N$8
  Top 0.66: R7.2 IC2.1
N$9
  Top 0.66: IC2.13 103.5,47.95 R9.1
N$10
  Top 0.66: IC2.7 90.81,66.36 R8.1
  Bottom 0.66: IC2.7 90.81,63.5 91.44,64.14 100.33,64.14 100.97,63.5 IC2.3
N$11
  Top 0.66: R9.2 106.05,47.95 IC2.14 109.86,53.34 111.12,54.61 R11.2
N$12
  Top 0.66: 95.89,59.05 94.93,58.1 R12.2 85.72,61.59 R20.2 | 95.89,59.05 IC2.5 | R11.1 96.84,58.1 95.89,59.05
N$13
  Top 0.66: R13.2 90.81,47.95 IC2.8 87,53.34 85.72,54.61 R12.1
N$14
  Top 0.508: 102.23,17.78 102.23,28.57
  Top 0.66: IC8.4 98.42,13.97 102.23,17.78 | 102.23,28.57 106.05,32.38 IC7.11
N$15
  Top 0.508: 104.78,17.78 104.78,28.57
  Top 0.66: IC8.5 100.97,13.97 104.78,17.78 | 104.78,28.57 108.58,32.38 IC7.10
N$16
  Top 0.508: 107.31,17.78 107.31,28.57
  Top 0.66: IC8.6 103.5,13.97 107.31,17.78 | 107.31,28.57 111.12,32.38 IC7.9
N$17
  Top 0.66: IC8.7 106.05,13.97 111.12,19.05 IC7.8
N$18
  Top 0.66: R14.1 28.83,85.72
  Top 1.5: Q3.1 28.83,85.72 28.83,74.55 24.77,70.48 Q4.C
N$19
  Top 0.66: IC7.7 IC8.9
N$20
  Top 0.66: IC7.6 IC8.10
N$21
  Top 0.66: IC7.5 IC8.11
N$22
  Top 0.66: IC7.4 IC8.12
N$23
  Top 0.66: Q4.B 31.5,68.2 VR1.C R15.1
N$24
  Top 1.5: D2.C 22.23,75.92 Q4.E
N$25
  Top 0.66: IC2.9 93.34,47.95 R13.1
N$26
  Top 0.66: IC7.15 IC2.10
N$27  (via drill 0.2)
  Top 0.66: R21.1 v125.73,17.14 JP1.4 | v118.11,17.14 R16.1
  Bottom 0.66: v125.73,17.14 v118.11,17.14
N$30
  Top 0.66: R18.2 R17.1
N$31
  Top 0.66: R22.2 28.57,36.83 24.13,41.27 24.13,46.99 22.66,48.46 IC5.4
N$32
  Top 0.66: R17.2 R19.1 VR1.R
N$33
  Top 1.1: IC5.2 18.21,51.87 16.51,50.16 D3.C L1.1
SCL
  Bottom 0.508: 97.16,9.53 97.16,15.88
  Bottom 0.66: JP1.7 133.35,6.99 131.44,8.89 97.79,8.89 97.16,9.53 | 97.16,15.88 95.89,17.14 IC8.14
SDA
  Bottom 0.508: 94.61,9.53 94.61,15.88
  Bottom 0.66: JP1.6 130.81,6.99 130.18,7.62 96.52,7.62 94.61,9.53 | 94.61,15.88 93.34,17.14 IC8.15
U_BATT
  Top 0.66: R3.2 R4.2 135.57,37.78 133.35,35.56 IC6.CH1
U_PSU  (via drill 0.3)
  Top 0.66: R1.1 132.72,81.92 | 132.72,81.92 R2.2 | v134.62,81.92 132.72,81.92
  Bottom 0.66: IC6.CH0 135.89,80.64 v134.62,81.92

### Text on the board
tDocu: + | - | 12V | + | + | - | PSU | - | + | - | BATT | GND / CS / MOSI / MISO / CLK / SDA / SCL / GND | SUPPLY_BOARD_1.1 | 5.2V | 5.0V | 3.3V | GND